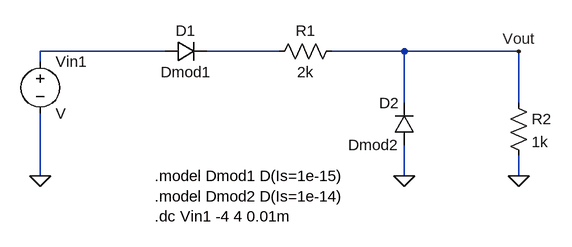
[diagram p0: schematic Draft3-2.asc]
Draft3-2.asc, the LTspice schematic file:
Version 4
SHEET 1 880 680
WIRE 128 288 -64 288
WIRE 304 288 192 288
WIRE 496 288 384 288
WIRE 672 288 496 288
WIRE -64 304 -64 288
WIRE 496 368 496 288
WIRE 672 368 672 288
WIRE -64 480 -64 384
WIRE 496 480 496 432
WIRE 672 480 672 448
FLAG 496 480 0
FLAG 672 480 0
FLAG -64 480 0
FLAG 672 288 Vout
SYMBOL diode 128 304 R270
WINDOW 0 32 32 VTop 2
WINDOW 3 0 32 VBottom 2
SYMATTR InstName D1
SYMATTR Value Dmod1
SYMBOL diode 512 432 R180
WINDOW 0 24 64 Left 2
WINDOW 3 24 0 Left 2
SYMATTR InstName D2
SYMATTR Value Dmod2
SYMBOL res 400 272 R90
WINDOW 0 0 56 VBottom 2
WINDOW 3 32 56 VTop 2
SYMATTR InstName R1
SYMATTR Value 2k
SYMBOL res 656 352 R0
SYMATTR InstName R2
SYMATTR Value 1k
SYMBOL voltage -64 288 R0
SYMATTR InstName Vin1
TEXT 112 480 Left 2 !.model Dmod1 D(Is=1e-15)\n.model Dmod2 D(Is=1e-14)\n.dc Vin1 -4 4 0.01m

The netlist it stands for:
* Draft3-2.asc
D1 N001 N002 Dmod1
D2 0 Vout Dmod2
R1 Vout N002 2k
R2 Vout 0 1k
Vin1 N001 0 V
.model D D
.lib standard.dio
.model Dmod1 D(Is=1e-15)
.model Dmod2 D(Is=1e-14)
.dc Vin1 -4 4 0.01m
.backanno
.end